# Altium schematic sheet MainBoard.SchDoc
size A
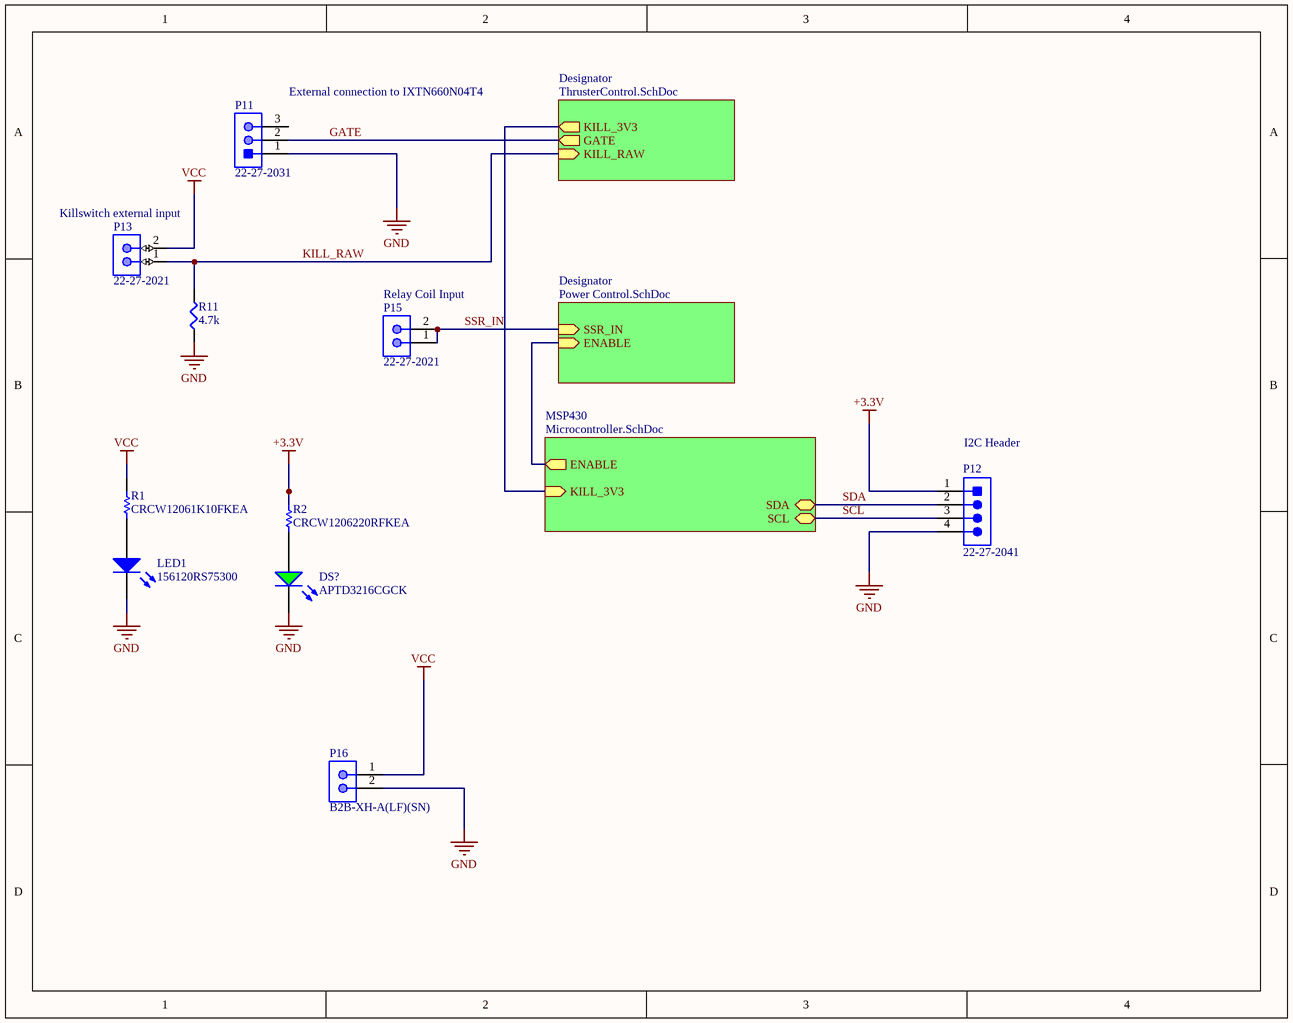
[diagram p0: MainBoard.SchDoc]

## Parts
DS?  APTD3216CGCK  [KING-APTD3216CGCK_V]
LED1  156120RS75300  [1206  CYLINDRICAL- Reverse Use]
P11  22-27-2031  [MOLX-22-27-2031_V]
P12  22-27-2041  [MOLX-22-27-2041_V]
P13  22-27-2021  [MOLX-22-27-2021_V]
P15  22-27-2021  [MOLX-22-27-2021_V]
P16  B2B-XH-A(LF)(SN)  [JST-B2B-XH-A_V]
R1  CRCW12061K10FKEA  [RESC3216X60X45LL10T20]
R2  CRCW1206220RFKEA  [RESC3216X60X45ML10T20]
R11  4.7k  [SMD-1206-RES]

## Sub-sheets
Designator = Power Control.SchDoc: SSR_IN (in), ENABLE (in)
Designator = ThrusterControl.SchDoc: GATE (out), KILL_RAW (in), KILL_3V3 (out)
MSP430 = Microcontroller.SchDoc: ENABLE (out), KILL_3V3 (in), SCL (bidir), SDA (bidir)

## Nets
+3.3V: P12.1 R2.2
GND: DS?.2(K) LED1.1(K) P11.1(Source) P12.4 P16.2 R11.1
VCC: P13.2 P16.1 R1.2
GATE: P11.2(Gate) ; sheet Designator/GATE
KILL_RAW: P13.1 R11.2 ; sheet Designator/KILL_RAW
SCL: P12.3 ; sheet MSP430/SCL
SDA: P12.2 ; sheet MSP430/SDA
SSR_IN: P15.1 P15.2 ; sheet Designator/SSR_IN
NetDS?_1: DS?.1(A) R2.1
NetLED1_2: LED1.2(A) R1.1
(unnamed): sheet MSP430/ENABLE, sheet Designator/ENABLE
(unnamed): sheet MSP430/KILL_3V3, sheet Designator/KILL_3V3

Not connected (* = marked no-connect by the designer): P11 3(Drain)

## Notes on the sheet
- (near P11) External connection to IXTN660N04T4
- (near P13) Killswitch external input
- (near P15) Relay Coil Input
- (near P12) I2C Header

## Library data of the parts
DS? = CMP-2000-05792-1: Chip LED Lamp, Green, 5 V, 30 mA, -40 to 85 degC, 2-Pin SMD, RoHS, Tape and Reel; Manufacturer: Kingbright; Wavelength - Dominant: 570nm; Online Catalog: 3.2mmx1.6mmRoundwithDomedTop1206PackageLEDs; Viewing Angle: 50°; Voltage - Forward (Vf) (Typ): 2.1V; Lens Type: Clear; Wavelength - Peak: 574nm; Other Names: 754-1152-2; 3D Model: APTD3216x.sldprt / APTD3216x.pro / APTD3216x.igs / APTD3216x.stp; Catalog Drawings: APTD3216SeriesTop / APTD3216SeriesSide; Current - Test: 20mA; Millicandela Rating: 300mcd; Lens Style/Size: RoundwithDomedTop,1.6mm; Standard Package: 2,000; Datasheet URL: https://www.kingbrightusa.com/images/catalog/spec/APTD3216CGCK.pdf; Family: LEDIndication-Discrete; Category: Optoelectronics; Package Reference: APTD3216CGCK; Datasheet Version: Rev. V.17B, 04/2015; Package / Case: 1206(3216Metric); Mounting Technology: SurfaceMount; Color: Green; Packaging: Tape&Reel(TR); Manufacturer URL: http://www.kingbright.com/; Height: 1.80mm; Package Description: 2-Pin Surface Mount Device, Body 3.2 x 1.6 mm; Mounting Type: SurfaceMount; Size / Dimension: 3.20mmLx1.60mmW
LED1 = CMP-1428-00003-2: SMD mono-color reverse mount waterclear Chip LED, WL-SMRW, Red; Manufacturer: Wuerth Elektronik; Lens Type: Cylindrical; Color: Red; PackageReference: 1206  CYLINDRICAL- Reverse Use; ComponentLink2Description: Datasheet; PartNumber: 156120RS75300; ComponentLink1Description: Manufacturer URL; ComponentLink2URL: http://katalog.we-online.com/led/datasheet/156120RS75300.pdf; ComponentLink1URL: http://www.we-online.com
P11 = CMP-2000-05538-1: Male Header, Pitch 2.54 mm, 1 x 3 Position, Height 11.7 mm, Tail Length 3.56 mm, -40 to 80 degC, RoHS, Bulk; Manufacturer: Molex; Voltage rating: 250V; Current rating: 4A; Package Reference: 22-27-2031; Housing material: Nylon(UL94V-0); Operating temperature: 0°Cto+75°C; Package Description: Male Header, Pitch 2.54 mm, 1 x 3 Position, Height 11.7 mm, Tail Length 3.56 mm; Package URL: http://www.molex.com/pdm_docs/sd/022272031_sd.pdf; Datasheet Version: 06/2016; Manufacturer URL: http://www.molex.com/; Mounting Technology: ThroughHole; Datasheet URL: http://www.molex.com/webdocs/datasheets/pdf/en-us/0022272031_PCB_HEADERS.pdf; Contact material: Tinplatedbrass
P12 = CMP-2000-05243-1: Male Header, Pitch 2.54 mm, 1 x 4 Position, Height 11.7 mm, Tail Length 3.56 mm, RoHS, Bulk; Manufacturer: Molex; Voltage rating: 250V; Current rating: 4A; Datasheet Version: Rev. F, 06/2009; Operating temperature: 0degCto+75degC; Contact material: Tinplatedbrass; Manufacturer URL: http://www.molex.com/; Housing material: Nylon(UL94V-0); Datasheet URL: http://www.molex.com/pdm_docs/sd/022272041_sd.pdf
P13 P15 = CMP-2000-05537-1: Male Header, Pitch 2.54 mm, 1 x 2 Position, Height 11.7 mm, Tail Length 3.56 mm, 0 to 75 degC, RoHS, Bulk; Manufacturer: Molex; PartNumber: 0022272021; Current rating: 4A; Package Version: Rev. BC, 02/2012; Voltage rating: 250V; No. of Positions: 2; Pitch: 2.54mm; No. of Rows: 1; Orientation: Vertical; Operating temperature: 0°Cto+75°C; Manufacturer URL: http://www.molex.com/; Mounting Technology: ThroughHole; Housing material: Nylon(UL94V-0); Package Description: 2-Leads Header, Body 5.08 x 5.8 mm, Pitch 2.54 mm; Voltage - Max: 250V; Datasheet URL: http://www.molex.com/pdm_docs/sd/022272021_sd.pdf; Package Reference: 22-27-2021; Contact material: Tinplatedbrass; Current - Max: 4A; Datasheet Version: Rev. F, 06/2009
P16 = CMP-2000-05888-1: Male Header, Pitch 2.5 mm, 1 x 2 Position, Height 7 mm, Tail Length 3.4 mm, -25 to 85 degC, RoHS, Bulk; Manufacturer: JST; No of Positions: 2; Pitch: 2.5mm; Style/Orientation: StraightHeader/Plug; Datasheet Version: 05/2016; Package Description: Male Header, Pitch 2.5 mm, 1 x 2 Position, Height 7 mm, Tail Length 3.4 mm; Package Reference: B2B-XH-A; Mounting Technology: ThroughHole; Type: ShroudedHeader; Datasheet URL: http://www.jst-mfg.com/product/pdf/eng/eXH.pdf; Manufacturer URL: http://www.jst.com/home2.html; Termination: Crimp
R1 = CMP-2003-01873-1: Manufacturer: Vishay Dale; Part Number: CRCW12061K10FKEA
R2 = CMP-2003-01956-1: Manufacturer: Vishay Dale; Part Number: CRCW1206220RFKEA
R11 = ERJ-8ENF4701V: RES SMD 4.7K OHM 1% 1/4W 1206; Manufacturer: Panasonic Electronic Components; Factory Stock: 0; Unit Price (USD): 0.00933; @ qty: 1500; Minimum Quantity: 1; Power (Watts): 0.25W, 1/4W; Temperature Coefficient: ±100ppm/°C; Part Number: ERJ-8ENF4701V; Datasheets: http://industrial.panasonic.com/www-cgi/jvcr13pz.cgi?E+PZ+3+AOA0002+ERJ8ENF4701V+7+WW; Image: //media.digikey.com/Renders/Panasonic%20Renders/ERJ-1206%20Pkg.jpg; Digi-Key Part Number: P4.70KFCT-ND; Quantity Available: 213244; Packaging: Cut Tape (CT); Series: ERJ; Part Status: Active; Value: 4.7k; Tolerance: ±1%; Composition: Thick Film; Features: Automotive AEC-Q200; Operating Temperature: -55°C ~ 155°C; Package / Case: 1206 (3216 Metric); Supplier Device Package: 1206; Size / Dimension: 0.126" L x 0.063" W (3.20mm x 1.60mm); Height - Seated (Max): 0.028" (0.70mm); Number of Terminations: 2; Failure Rate: -